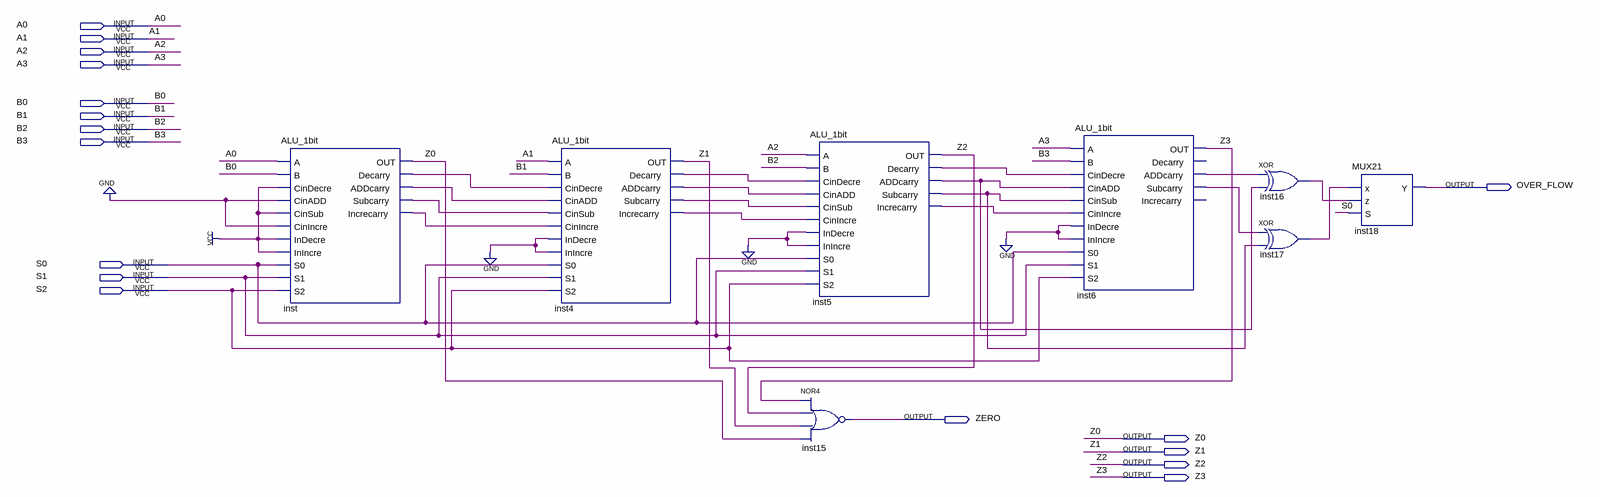
[diagram p0: schematic sheet]
// Quartus schematic ALU_4bit.bdf as structural Verilog: 8 symbols, 17 pins
module ALU_4bit (
  input  A0,
  input  A1,
  input  A2,
  input  A3,
  input  B0,
  input  B1,
  input  B2,
  input  B3,
  input  S0,
  input  S1,
  input  S2,
  output OVER_FLOW,
  output ZERO,
  output Z0,
  output Z1,
  output Z2,
  output Z3
);

  wire inst4_addcarry, inst4_decarry, inst4_increcarry, inst4_subcarry, inst5_addcarry, inst5_decarry,
       inst5_increcarry, inst5_subcarry, inst6_addcarry, inst6_subcarry, inst16_out, inst17_out,
       inst_addcarry, inst_decarry, inst_increcarry, inst_subcarry;

  ALU_1bit inst (
    .A(A0), .B(B0), .CinDecre(1'b1), .CinADD(1'b0), .CinSub(1'b1), .CinIncre(1'b0), .InDecre(1'b1),
    .InIncre(1'b1), .S0(S0), .S1(S1), .S2(S2), .OUT(Z0), .Decarry(inst_decarry), .ADDcarry(inst_addcarry),
    .Subcarry(inst_subcarry), .Increcarry(inst_increcarry));
  ALU_1bit inst4 (
    .A(A1), .B(B1), .CinDecre(inst_decarry), .CinADD(inst_addcarry), .CinSub(inst_subcarry),
    .CinIncre(inst_increcarry), .InDecre(1'b0), .InIncre(1'b0), .S0(S0), .S1(S1), .S2(S2), .OUT(Z1),
    .Decarry(inst4_decarry), .ADDcarry(inst4_addcarry), .Subcarry(inst4_subcarry),
    .Increcarry(inst4_increcarry));
  ALU_1bit inst5 (
    .A(A2), .B(B2), .CinDecre(inst4_decarry), .CinADD(inst4_addcarry), .CinSub(inst4_subcarry),
    .CinIncre(inst4_increcarry), .InDecre(1'b0), .InIncre(1'b0), .S0(S0), .S1(S1), .S2(S2), .OUT(Z2),
    .Decarry(inst5_decarry), .ADDcarry(inst5_addcarry), .Subcarry(inst5_subcarry),
    .Increcarry(inst5_increcarry));
  nor inst15 (ZERO, Z3, Z2, Z1, Z0);
  ALU_1bit inst6 (
    .A(A3), .B(B3), .CinDecre(inst5_decarry), .CinADD(inst5_addcarry), .CinSub(inst5_subcarry),
    .CinIncre(inst5_increcarry), .InDecre(1'b0), .InIncre(1'b0), .S0(S0), .S1(S1), .S2(S2), .OUT(Z3),
    .ADDcarry(inst6_addcarry), .Subcarry(inst6_subcarry));  // open: Decarry, Increcarry
  xor inst16 (inst16_out, inst6_addcarry, inst5_addcarry);
  xor inst17 (inst17_out, inst6_subcarry, inst5_subcarry);
  MUX21 inst18 (.x(inst17_out), .z(inst16_out), .S(S0), .Y(OVER_FLOW));
endmodule
